# Altium schematic sheet Pressure_PM.SchDoc
size A4
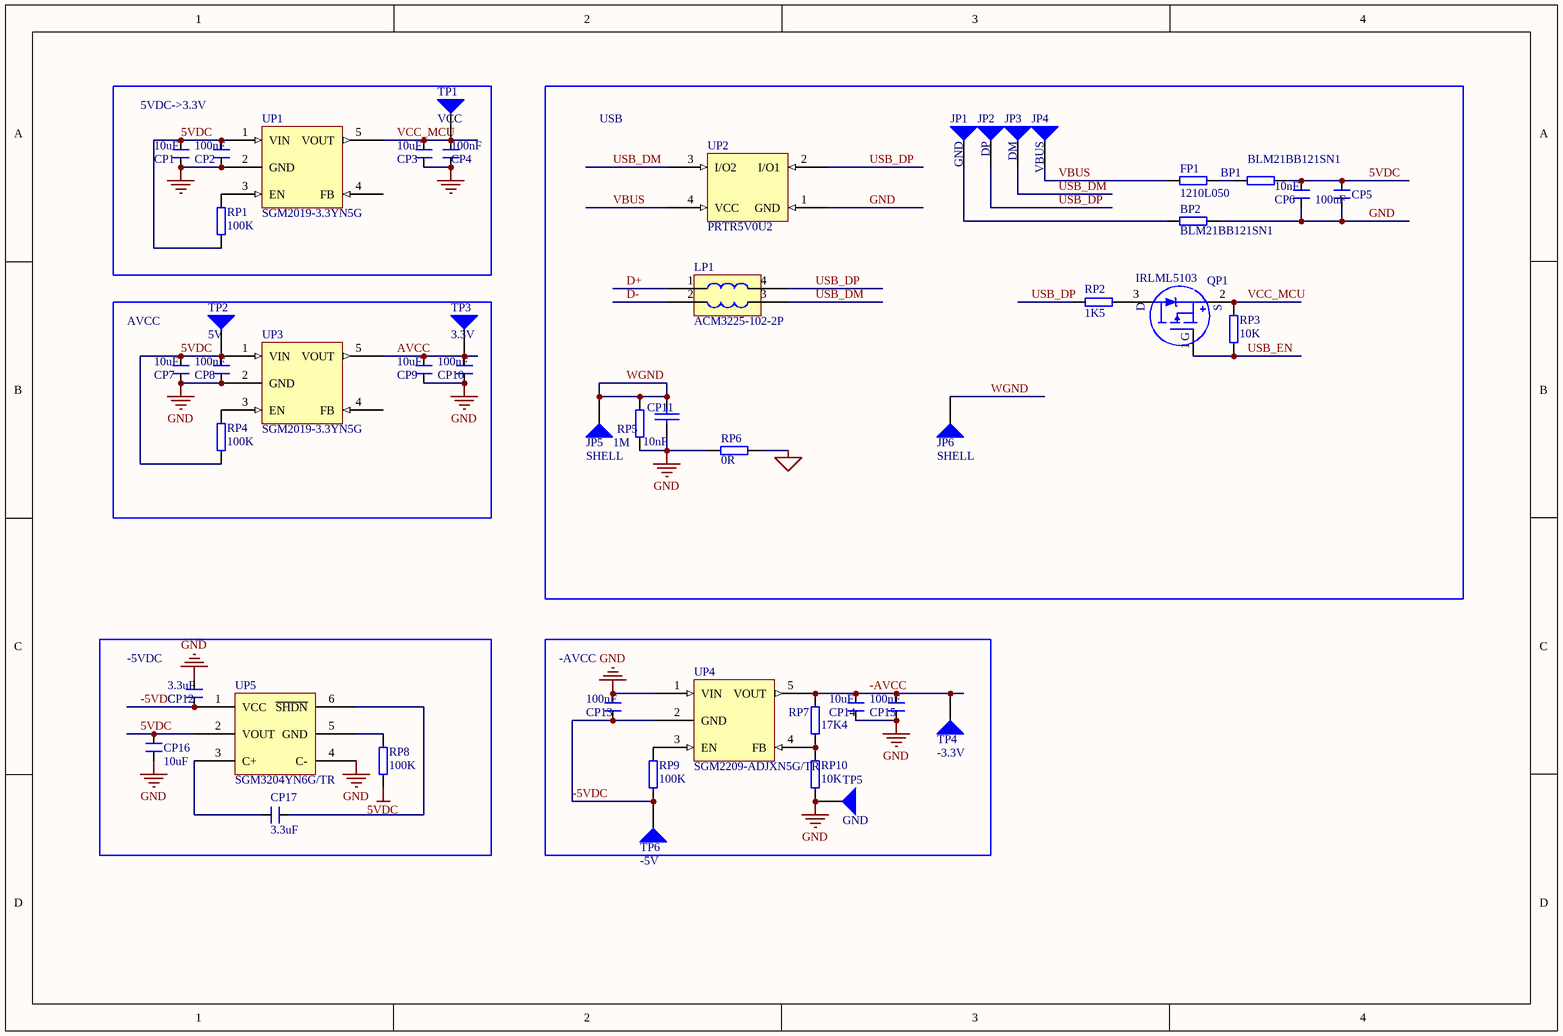
[diagram p0: Pressure_PM.SchDoc]

## Parts
BP1  BLM21BB121SN1  [C0805]
BP2  BLM21BB121SN1  [C0805]
CP1  10uF  [C0805]
CP2  100nF  [C0603_HSC100]
CP3  10uF  [C0805]
CP4  100nF  [C0603_HSC100]
CP5  100uF  [c6032]
CP6  10nF  [C0603_HSC100]
CP7  10uF  [C0805]
CP8  100nF  [C0603_HSC100]
CP9  10uF  [C0805]
CP10  100nF  [C0603_HSC100]
CP11  10nF  [C0603_HSC100]
CP12  3.3uF  [C0805]
CP13  100nF  [C0603_HSC100]
CP14  10uF  [C0805]
CP15  100nF  [C0603_HSC100]
CP16  10uF  [C0805]
CP17  3.3uF  [C0805]
FP1  1210L050  [C1206]
JP1  GND  [TPAD-CY]
JP2  DP  [TPAD-CY]
JP3  DM  [TPAD-CY]
JP4  VBUS  [TPAD-CY]
JP5  SHELL  [TPAD-CY]
JP6  SHELL  [TPAD-HXS]
LP1  ACM3225-102-2P  [3225]
QP1  IRLML5103  [TSMT3]
RP1  100K  [R0603_HSC100]
RP2  1K5  [R0603_HSC100]
RP3  10K  [R0603_HSC100]
RP4  100K  [R0603_HSC100]
RP5  1M  [R0603_HSC100]
RP6  0R  [R0603_HSC100]
RP7  17K4  [R0603_HSC100]
RP8  100K  [R0603_HSC100]
RP9  100K  [R0603_HSC100]
RP10  10K  [R0603_HSC100]
TP1  VCC  [TPAD-2MM]
TP2  5V  [TPAD-2MM]
TP3  3.3V  [TPAD-2MM]
TP4  -3.3V  [TPAD-2MM]
TP5  GND  [TPAD-2MM]
TP6  -5V  [TPAD-2MM]
UP1  SGM2019-3.3YN5G  [SOT23-5]
UP2  PRTR5V0U2  [SOT143B]
UP3  SGM2019-3.3YN5G  [SOT23-5]
UP4  SGM2209-ADJXN5G/TR  [SOT23-5]
UP5  SGM3204YN6G/TR  [SOT23-6M]

## Blocks framed on the sheet
5VDC->3.3V: CP1-CP4 RP1 TP1 UP1
USB: BP1 BP2 CP5 CP6 CP11 FP1 JP1-JP6 LP1 QP1 RP2 RP3 RP5 RP6 UP2
AVCC: CP7-CP10 RP4 TP2 TP3 UP3
-5VDC: CP12 CP16 CP17 RP8 UP5
-AVCC: CP13-CP15 RP7 RP9 RP10 TP4-TP6 UP4

## Nets
5VDC: BP1.1 CP1.2 CP2.2 CP5.1 CP6.2 CP7.2 CP8.2 CP16.1 RP1.2 RP4.2 RP8.1 TP2.1 UP1.1(VIN) UP3.1(VIN) UP5.2(VOUT)
AGND: RP6.1
GND: BP2.1 CP1.1 CP2.1 CP3.1 CP4.1 CP5.2 CP6.1 CP7.1 CP8.1 CP9.1 CP10.1 CP11.2 CP12.2 CP13.2 CP14.1 CP15.1 CP16.2 RP5.1 RP6.2 RP10.2 TP5.1 UP1.2(GND) UP2.1(GND) UP3.2(GND) UP4.1(VIN) UP5.4(C-)
-5VDC: CP12.1 CP13.1 RP9.2 TP6.1 UP4.2(GND) UP5.1(VCC)
-AVCC: CP14.2 CP15.2 RP7.1 TP4.1 UP4.5(VOUT)
AVCC: CP9.2 CP10.2 TP3.1 UP3.5(VOUT)
D+: LP1.1
D-: LP1.2
USB_DM: JP3.1 LP1.3 UP2.3(I/O2)
USB_DP: JP2.1 LP1.4 RP2.2 UP2.2(I/O1)
USB_EN: QP1.1 RP3.2
VBUS: FP1.2 JP4.1 UP2.4(VCC)
VCC_MCU: CP3.2 CP4.2 QP1.2 RP3.1 TP1.1 UP1.5(VOUT)
WGND: CP11.1 JP5.1 JP6.1 RP5.2
NetBP1_2: BP1.2 FP1.1
NetBP2_2: BP2.2 JP1.1
NetCP17_1: CP17.1 UP5.6(~{SHDN})
NetCP17_2: CP17.2 UP5.3(C+)
NetQP1_3: QP1.3 RP2.1
NetRP1_1: RP1.1 UP1.3(EN)
NetRP4_1: RP4.1 UP3.3(EN)
NetRP7_2: RP7.2 RP10.1 UP4.4(FB)
NetRP8_2: RP8.2 UP5.5(GND)
NetRP9_1: RP9.1 UP4.3(EN)

Not connected (* = marked no-connect by the designer): UP1 4(FB); UP3 4(FB)

## Notes on the sheet
- (in symbol RTR030P02) D; S; G

## Library data of the parts
BP1 BP2 FP1 RP1-RP10 = RES
CP1-CP10 CP12-CP17 = CAP_M
CP11 = CAP: Capacitor
JP1-JP6 TP1-TP6 = TPAD: Connector
LP1 = ACM3225-102-2P: ACM3225
QP1 = RTR030P02
UP1 UP3 UP4 = XC6201: XC6201M331
UP5 = LTC1983